# EAGLE schematic CANDevice (EAGLE 9.6.2)
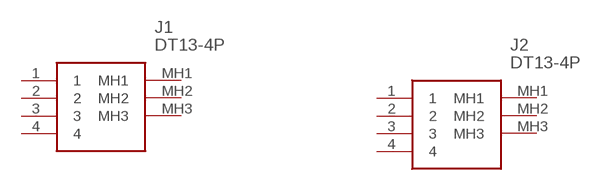
[diagram p0: schematic, sheet 1]

## Parts
J1  DT13-4P  [DT134P]
J2  DT13-4P  [DT134P]
Unconnected: J1.1 J1.2 J1.3 J1.4 J1.MH1 J1.MH2 J1.MH3 J2.1 J2.2 J2.3 J2.4 J2.MH1 J2.MH2 J2.MH3

## Library data of the parts
J1 J2 = DT13-4P:DT13-4P: HDR, 4P, GRY, RA, NI/CU RECEPTACLE HEADER 4 PIN 90 DEG DT SERIES Source: Datasheet <https://www.te.com/commerce/DocumentDelivery/DDEController?Action=srchrtrv&DocNm=DT13-4P&DocType=Customer Drawing&DocLang=English>; DESCRIPTION: HDR, 4P, GRY, RA, NI/CU RECEPTACLE HEADER 4 PIN 90 DEG DT SERIES; HEIGHT: 36.12mm; MANUFACTURER_NAME: TE Connectivity; MANUFACTURER_PART_NUMBER: DT13-4P; MOUSER_PART_NUMBER: 571-DT13-4P; MOUSER_PRICE-STOCK: https://www.mouser.co.uk/ProductDetail/TE-Connectivity-DEUTSCH/DT13-4P?qs=vkMqrgFpRajaLeBfOZKzWQ%3D%3D